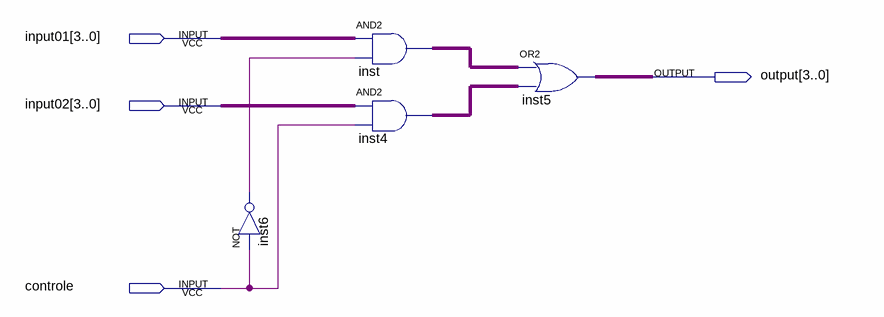
[diagram p0: schematic sheet]
// Quartus schematic multiplexador21-vetor.bdf as structural Verilog: 4 symbols, 4 pins
module \multiplexador21-vetor  (
  input  [3:0] input01,
  input  [3:0] input02,
  input  controle,
  output [3:0] \output 
);

  wire inst6_out;
  wire [3:0] inst4_out, inst_out;

  not inst6 (inst6_out, controle);
  assign inst_out = input01 & {4{inst6_out}};  // AND2 inst, 4 bits wide
  assign inst4_out = input02 & {4{controle}};  // AND2 inst4, 4 bits wide
  assign \output  = inst_out | inst4_out;  // OR2 inst5, 4 bits wide
endmodule
